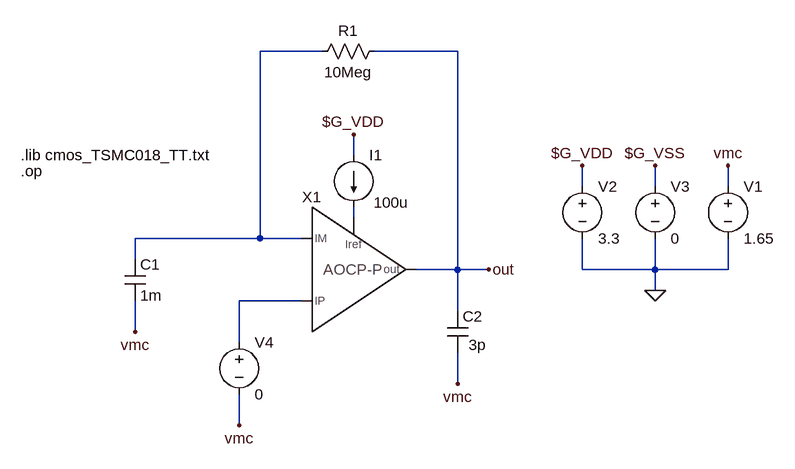
[diagram p0: schematic test_ao_cp_p_OP.asc]
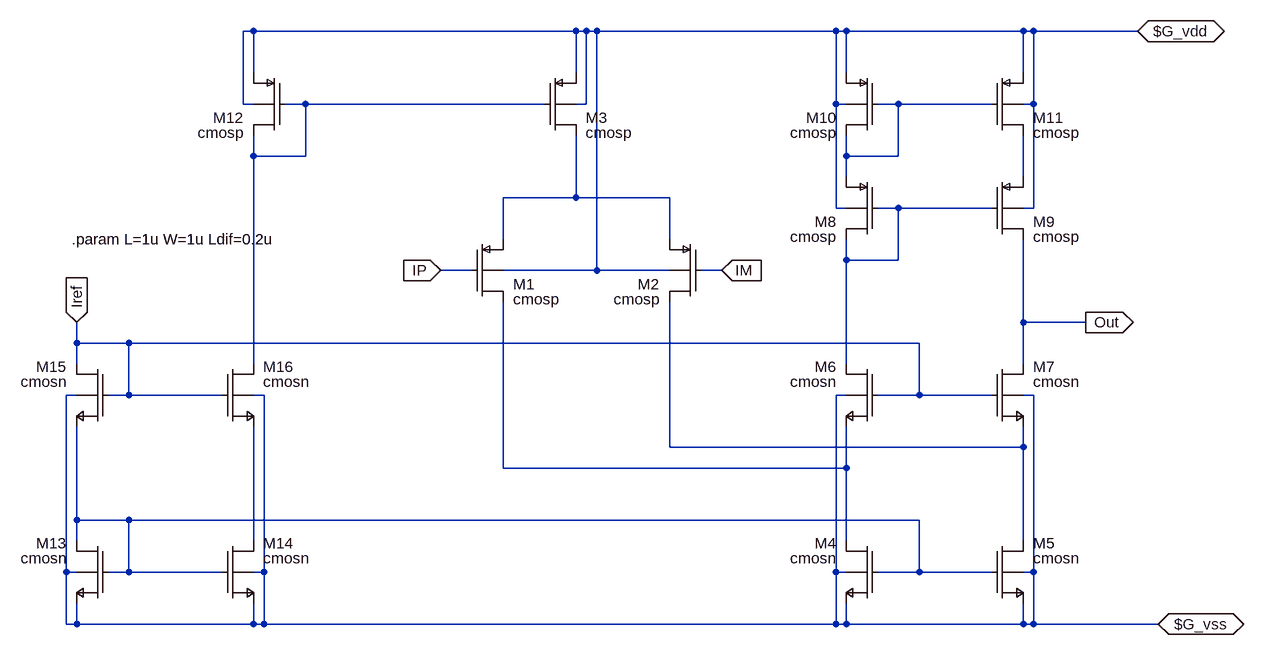
[diagram p1: sub-circuit ao_cp_p.asc]
test_ao_cp_p_OP.asc, the LTspice schematic file:
Version 4
SHEET 1 1600 816
WIRE 592 96 496 96
WIRE 800 96 672 96
WIRE 640 256 640 224
WIRE 992 304 992 272
WIRE 1104 304 1104 272
WIRE 1216 304 1216 272
WIRE 640 352 640 336
WIRE 496 384 496 96
WIRE 496 384 304 384
WIRE 560 384 496 384
WIRE 304 416 304 384
WIRE 800 432 800 96
WIRE 800 432 736 432
WIRE 848 432 800 432
WIRE 992 432 992 384
WIRE 1104 432 1104 384
WIRE 1104 432 992 432
WIRE 1216 432 1216 384
WIRE 1216 432 1104 432
WIRE 1104 464 1104 432
WIRE 560 480 464 480
WIRE 800 496 800 432
WIRE 304 528 304 480
WIRE 464 544 464 480
WIRE 800 608 800 560
WIRE 464 672 464 624
FLAG 1104 464 0
FLAG 992 272 $G_VDD
FLAG 1104 272 $G_VSS
FLAG 1216 272 vmc
FLAG 304 528 vmc
FLAG 848 432 out
FLAG 464 672 vmc
FLAG 800 608 vmc
FLAG 640 224 $G_VDD
SYMBOL voltage 992 288 R0
WINDOW 123 0 0 Left 2
WINDOW 39 0 0 Left 2
SYMATTR InstName V2
SYMATTR Value 3.3
SYMBOL voltage 1104 288 R0
WINDOW 123 0 0 Left 2
WINDOW 39 0 0 Left 2
SYMATTR InstName V3
SYMATTR Value 0
SYMBOL voltage 1216 288 R0
WINDOW 123 0 0 Left 2
WINDOW 39 0 0 Left 2
SYMATTR InstName V1
SYMATTR Value 1.65
SYMBOL res 688 80 R90
WINDOW 0 0 56 VBottom 2
WINDOW 3 32 56 VTop 2
SYMATTR InstName R1
SYMATTR Value 10Meg
SYMBOL cap 288 416 R0
SYMATTR InstName C1
SYMATTR Value 1m
SYMBOL current 640 256 R0
WINDOW 123 0 0 Left 2
WINDOW 39 0 0 Left 2
WINDOW 3 31 73 Left 2
SYMATTR Value 100u
SYMATTR InstName I1
SYMBOL cap 784 496 R0
WINDOW 3 33 52 Left 2
SYMATTR InstName C2
SYMATTR Value 3p
SYMBOL voltage 464 528 R0
WINDOW 123 0 0 Left 2
WINDOW 39 0 0 Left 2
SYMATTR InstName V4
SYMATTR Value 0
SYMBOL ao_cp_p 608 432 R0
SYMATTR InstName X1
TEXT 128 256 Left 2 !.lib cmos_TSMC018_TT.txt
TEXT 128 280 Left 2 !.op

ao_cp_p.asc, the sub-circuit schematic file:
Version 4
SHEET 1 2836 1240
WIRE 512 -432 496 -432
WIRE 1008 -432 512 -432
WIRE 1024 -432 1008 -432
WIRE 1040 -432 1024 -432
WIRE 1408 -432 1040 -432
WIRE 1424 -432 1408 -432
WIRE 1696 -432 1424 -432
WIRE 1712 -432 1696 -432
WIRE 1872 -432 1712 -432
WIRE 512 -368 512 -432
WIRE 1008 -368 1008 -432
WIRE 1424 -368 1424 -432
WIRE 1696 -368 1696 -432
WIRE 496 -320 496 -432
WIRE 512 -320 496 -320
WIRE 592 -320 560 -320
WIRE 960 -320 592 -320
WIRE 1024 -320 1024 -432
WIRE 1024 -320 1008 -320
WIRE 1408 -320 1408 -432
WIRE 1424 -320 1408 -320
WIRE 1504 -320 1472 -320
WIRE 1648 -320 1504 -320
WIRE 1712 -320 1712 -432
WIRE 1712 -320 1696 -320
WIRE 512 -240 512 -272
WIRE 592 -240 592 -320
WIRE 592 -240 512 -240
WIRE 1424 -240 1424 -272
WIRE 1504 -240 1504 -320
WIRE 1504 -240 1424 -240
WIRE 1424 -208 1424 -240
WIRE 1696 -208 1696 -272
WIRE 1008 -176 1008 -272
WIRE 1008 -176 896 -176
WIRE 1152 -176 1008 -176
WIRE 1408 -160 1408 -320
WIRE 1424 -160 1408 -160
WIRE 1504 -160 1472 -160
WIRE 1648 -160 1504 -160
WIRE 1712 -160 1712 -320
WIRE 1712 -160 1696 -160
WIRE 896 -112 896 -176
WIRE 1152 -112 1152 -176
WIRE 1424 -80 1424 -112
WIRE 1504 -80 1504 -160
WIRE 1504 -80 1424 -80
WIRE 848 -64 800 -64
WIRE 1040 -64 1040 -432
WIRE 1040 -64 896 -64
WIRE 1152 -64 1040 -64
WIRE 1232 -64 1200 -64
WIRE 1696 16 1696 -112
WIRE 1792 16 1696 16
WIRE 240 48 240 16
WIRE 320 48 240 48
WIRE 1536 48 320 48
WIRE 240 80 240 48
WIRE 512 80 512 -240
WIRE 1424 80 1424 -80
WIRE 1696 80 1696 16
WIRE 240 128 224 128
WIRE 320 128 320 48
WIRE 320 128 288 128
WIRE 464 128 320 128
WIRE 528 128 512 128
WIRE 1424 128 1408 128
WIRE 1536 128 1536 48
WIRE 1536 128 1472 128
WIRE 1648 128 1536 128
WIRE 1712 128 1696 128
WIRE 1152 208 1152 -16
WIRE 1696 208 1696 176
WIRE 1696 208 1152 208
WIRE 896 240 896 -16
WIRE 1424 240 1424 176
WIRE 1424 240 896 240
WIRE 240 320 240 176
WIRE 320 320 240 320
WIRE 1536 320 320 320
WIRE 240 352 240 320
WIRE 512 352 512 176
WIRE 1424 352 1424 240
WIRE 1696 352 1696 208
WIRE 224 400 224 128
WIRE 240 400 224 400
WIRE 320 400 320 320
WIRE 320 400 288 400
WIRE 464 400 320 400
WIRE 528 400 528 128
WIRE 528 400 512 400
WIRE 1408 400 1408 128
WIRE 1424 400 1408 400
WIRE 1536 400 1536 320
WIRE 1536 400 1472 400
WIRE 1648 400 1536 400
WIRE 1712 400 1712 128
WIRE 1712 400 1696 400
WIRE 224 480 224 400
WIRE 240 480 240 448
WIRE 240 480 224 480
WIRE 512 480 512 448
WIRE 512 480 240 480
WIRE 528 480 528 400
WIRE 528 480 512 480
WIRE 1408 480 1408 400
WIRE 1408 480 528 480
WIRE 1424 480 1424 448
WIRE 1424 480 1408 480
WIRE 1696 480 1696 448
WIRE 1696 480 1424 480
WIRE 1712 480 1712 400
WIRE 1712 480 1696 480
WIRE 1904 480 1712 480
FLAG 800 -64 IP
IOPIN 800 -64 In
FLAG 1792 16 Out
IOPIN 1792 16 Out
FLAG 1232 -64 IM
IOPIN 1232 -64 In
FLAG 1872 -432 $G_vdd
IOPIN 1872 -432 BiDir
FLAG 1904 480 $G_vss
IOPIN 1904 480 BiDir
FLAG 240 16 Iref
IOPIN 240 16 In
SYMBOL pmosb 848 -112 R0
SYMATTR InstName M1
SYMATTR Value cmosp
SYMATTR Value2 l={L} w={W} ad={Ldif*W} as={Ldif*W} pd={(Ldif+W)*2} ps={(Ldif+W)*2} m=120
SYMBOL pmosb 1200 -112 M0
SYMATTR InstName M2
SYMATTR Value cmosp
SYMATTR Value2 l={L} w={W} ad={Ldif*W} as={Ldif*W} pd={(Ldif+W)*2} ps={(Ldif+W)*2} m=120
SYMBOL pmosb 960 -368 R0
SYMATTR InstName M3
SYMATTR Value cmosp
SYMATTR Value2 l={L} w={W} ad={Ldif*W} as={Ldif*W} pd={(Ldif+W)*2} ps={(Ldif+W)*2} m=152
SYMBOL nmosb 1472 352 M0
SYMATTR InstName M4
SYMATTR Value cmosn
SYMATTR Value2 l={L} w={W} ad={Ldif*W} as={Ldif*W} pd={(Ldif+W)*2} ps={(Ldif+W)*2} m=39.7
SYMBOL nmosb 1648 352 R0
SYMATTR InstName M5
SYMATTR Value cmosn
SYMATTR Value2 l={L} w={W} ad={Ldif*W} as={Ldif*W} pd={(Ldif+W)*2} ps={(Ldif+W)*2} m=39.7
SYMBOL nmosb 1472 80 M0
SYMATTR InstName M6
SYMATTR Value cmosn
SYMATTR Value2 l={L} w={W} ad={Ldif*W} as={Ldif*W} pd={(Ldif+W)*2} ps={(Ldif+W)*2} m=23.8
SYMBOL nmosb 1648 80 R0
SYMATTR InstName M7
SYMATTR Value cmosn
SYMATTR Value2 l={L} w={W} ad={Ldif*W} as={Ldif*W} pd={(Ldif+W)*2} ps={(Ldif+W)*2} m=23.8
SYMBOL pmosb 1472 -208 M0
SYMATTR InstName M8
SYMATTR Value cmosp
SYMATTR Value2 l={L} w={W} ad={Ldif*W} as={Ldif*W} pd={(Ldif+W)*2} ps={(Ldif+W)*2} m=114
SYMBOL pmosb 1648 -208 R0
SYMATTR InstName M9
SYMATTR Value cmosp
SYMATTR Value2 l={L} w={W} ad={Ldif*W} as={Ldif*W} pd={(Ldif+W)*2} ps={(Ldif+W)*2} m=114
SYMBOL pmosb 1472 -368 M0
SYMATTR InstName M10
SYMATTR Value cmosp
SYMATTR Value2 l={L} w={W} ad={Ldif*W} as={Ldif*W} pd={(Ldif+W)*2} ps={(Ldif+W)*2} m=114
SYMBOL pmosb 1648 -368 R0
SYMATTR InstName M11
SYMATTR Value cmosp
SYMATTR Value2 l={L} w={W} ad={Ldif*W} as={Ldif*W} pd={(Ldif+W)*2} ps={(Ldif+W)*2} m=114
SYMBOL pmosb 560 -368 M0
SYMATTR InstName M12
SYMATTR Value cmosp
SYMATTR Value2 l={L} w={W} ad={Ldif*W} as={Ldif*W} pd={(Ldif+W)*2} ps={(Ldif+W)*2} m=56.2
SYMBOL nmosb 288 352 M0
SYMATTR InstName M13
SYMATTR Value cmosn
SYMATTR Value2 l={L} w={W} ad={Ldif*W} as={Ldif*W} pd={(Ldif+W)*2} ps={(Ldif+W)*2} m=11.8
SYMBOL nmosb 464 352 R0
SYMATTR InstName M14
SYMATTR Value cmosn
SYMATTR Value2 l={L} w={W} ad={Ldif*W} as={Ldif*W} pd={(Ldif+W)*2} ps={(Ldif+W)*2} m=11.8
SYMBOL nmosb 288 80 M0
SYMATTR InstName M15
SYMATTR Value cmosn
SYMATTR Value2 l={L} w={W} ad={Ldif*W} as={Ldif*W} pd={(Ldif+W)*2} ps={(Ldif+W)*2} m=11.8
SYMBOL nmosb 464 80 R0
SYMATTR InstName M16
SYMATTR Value cmosn
SYMATTR Value2 l={L} w={W} ad={Ldif*W} as={Ldif*W} pd={(Ldif+W)*2} ps={(Ldif+W)*2} m=11.8
TEXT 232 -112 Left 2 !.param L=1u W=1u Ldif=0.2u

The netlist it stands for:
* test_ao_cp_p_OP.asc
V2 $G_VDD 0 3.3
V3 $G_VSS 0 0
V1 vmc 0 1.65
R1 out N001 10Meg
C1 N001 vmc 1m
I1 $G_VDD N002 100u
C2 out vmc 3p
V4 N003 vmc 0
XX1 N001 N003 out N002 ao_cp_p

* block symbol definitions
.subckt ao_cp_p IM IP out Iref
M1 N007 IP N004 $G_vdd cmosp l={L} w={W} ad={Ldif*W} as={Ldif*W} pd={(Ldif+W)*2} ps={(Ldif+W)*2} m=120
M2 N006 IM N004 $G_vdd cmosp l={L} w={W} ad={Ldif*W} as={Ldif*W} pd={(Ldif+W)*2} ps={(Ldif+W)*2} m=120
M3 N004 N001 $G_vdd $G_vdd cmosp l={L} w={W} ad={Ldif*W} as={Ldif*W} pd={(Ldif+W)*2} ps={(Ldif+W)*2} m=152
M4 N007 N008 $G_vss $G_vss cmosn l={L} w={W} ad={Ldif*W} as={Ldif*W} pd={(Ldif+W)*2} ps={(Ldif+W)*2} m=39.7
M5 N006 N008 $G_vss $G_vss cmosn l={L} w={W} ad={Ldif*W} as={Ldif*W} pd={(Ldif+W)*2} ps={(Ldif+W)*2} m=39.7
M6 N005 Iref N007 $G_vss cmosn l={L} w={W} ad={Ldif*W} as={Ldif*W} pd={(Ldif+W)*2} ps={(Ldif+W)*2} m=23.8
M7 Out Iref N006 $G_vss cmosn l={L} w={W} ad={Ldif*W} as={Ldif*W} pd={(Ldif+W)*2} ps={(Ldif+W)*2} m=23.8
M8 N005 N005 N002 $G_vdd cmosp l={L} w={W} ad={Ldif*W} as={Ldif*W} pd={(Ldif+W)*2} ps={(Ldif+W)*2} m=114
M9 Out N005 N003 $G_vdd cmosp l={L} w={W} ad={Ldif*W} as={Ldif*W} pd={(Ldif+W)*2} ps={(Ldif+W)*2} m=114
M10 N002 N002 $G_vdd $G_vdd cmosp l={L} w={W} ad={Ldif*W} as={Ldif*W} pd={(Ldif+W)*2} ps={(Ldif+W)*2} m=114
M11 N003 N002 $G_vdd $G_vdd cmosp l={L} w={W} ad={Ldif*W} as={Ldif*W} pd={(Ldif+W)*2} ps={(Ldif+W)*2} m=114
M12 N001 N001 $G_vdd $G_vdd cmosp l={L} w={W} ad={Ldif*W} as={Ldif*W} pd={(Ldif+W)*2} ps={(Ldif+W)*2} m=56.2
M13 N008 N008 $G_vss $G_vss cmosn l={L} w={W} ad={Ldif*W} as={Ldif*W} pd={(Ldif+W)*2} ps={(Ldif+W)*2} m=11.8
M14 N009 N008 $G_vss $G_vss cmosn l={L} w={W} ad={Ldif*W} as={Ldif*W} pd={(Ldif+W)*2} ps={(Ldif+W)*2} m=11.8
M15 Iref Iref N008 $G_vss cmosn l={L} w={W} ad={Ldif*W} as={Ldif*W} pd={(Ldif+W)*2} ps={(Ldif+W)*2} m=11.8
M16 N001 Iref N009 $G_vss cmosn l={L} w={W} ad={Ldif*W} as={Ldif*W} pd={(Ldif+W)*2} ps={(Ldif+W)*2} m=11.8
.param L=1u W=1u Ldif=0.2u
.ends ao_cp_p

.model NMOS NMOS
.model PMOS PMOS
.lib standard.mos
.lib cmos_TSMC018_TT.txt
.op
.backanno
.end